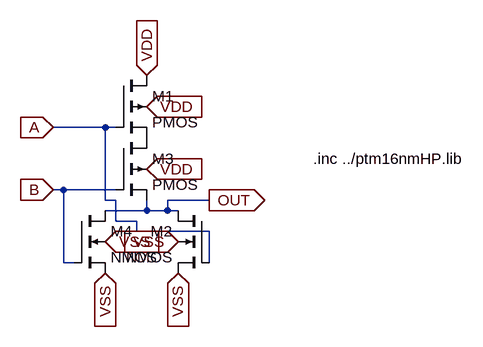
[diagram p0: schematic LOGIC_NOR_cCMOS.asc]
LOGIC_NOR_cCMOS.asc, the LTspice schematic file:
Version 4
SHEET 1 880 680
WIRE 64 96 -16 96
WIRE 80 96 64 96
WIRE 0 192 -16 192
WIRE 80 192 0 192
WIRE 64 208 64 96
WIRE 80 208 64 208
WIRE 224 208 160 208
WIRE 128 224 128 208
WIRE 128 224 64 224
WIRE 160 224 160 208
WIRE 160 224 128 224
WIRE 176 224 160 224
WIRE 80 240 80 208
WIRE 112 240 80 240
WIRE 112 256 112 240
WIRE 224 256 112 256
WIRE 0 304 0 192
WIRE 16 304 0 304
WIRE 224 304 224 256
FLAG 128 16 VDD
IOPIN 128 16 In
FLAG 128 64 VDD
IOPIN 128 64 In
FLAG 128 160 VDD
IOPIN 128 160 In
FLAG 176 272 VSS
IOPIN 176 272 In
FLAG 64 272 VSS
IOPIN 64 272 In
FLAG 64 320 VSS
IOPIN 64 320 In
FLAG 176 320 VSS
IOPIN 176 320 In
FLAG -16 96 A
IOPIN -16 96 In
FLAG -16 192 B
IOPIN -16 192 In
FLAG 224 208 OUT
IOPIN 224 208 Out
SYMBOL pmos4 80 16 R0
SYMATTR InstName M1
SYMATTR Value2 l=16n w=400n
SYMBOL nmos4 224 224 M0
SYMATTR InstName M2
SYMATTR Value2 l=16n w=500n
SYMBOL pmos4 80 112 R0
SYMATTR InstName M3
SYMATTR Value2 l=16n w=400n
SYMBOL nmos4 16 224 R0
SYMATTR InstName M4
SYMATTR Value2 l=16n w=500n
TEXT 384 144 Left 2 !.inc ../ptm16nmHP.lib

The netlist it stands for:
* LOGIC_NOR_cCMOS.asc
M1 VDD A P001 VDD PMOS l=16n w=400n
M2 OUT A VSS VSS NMOS l=16n w=500n
M3 P001 B OUT VDD PMOS l=16n w=400n
M4 OUT B VSS VSS NMOS l=16n w=500n
.model NMOS NMOS
.model PMOS PMOS
.lib standard.mos
.inc ../ptm16nmHP.lib
.backanno
.end